# Altium schematic sheet Endregulation.SchDoc
size A3
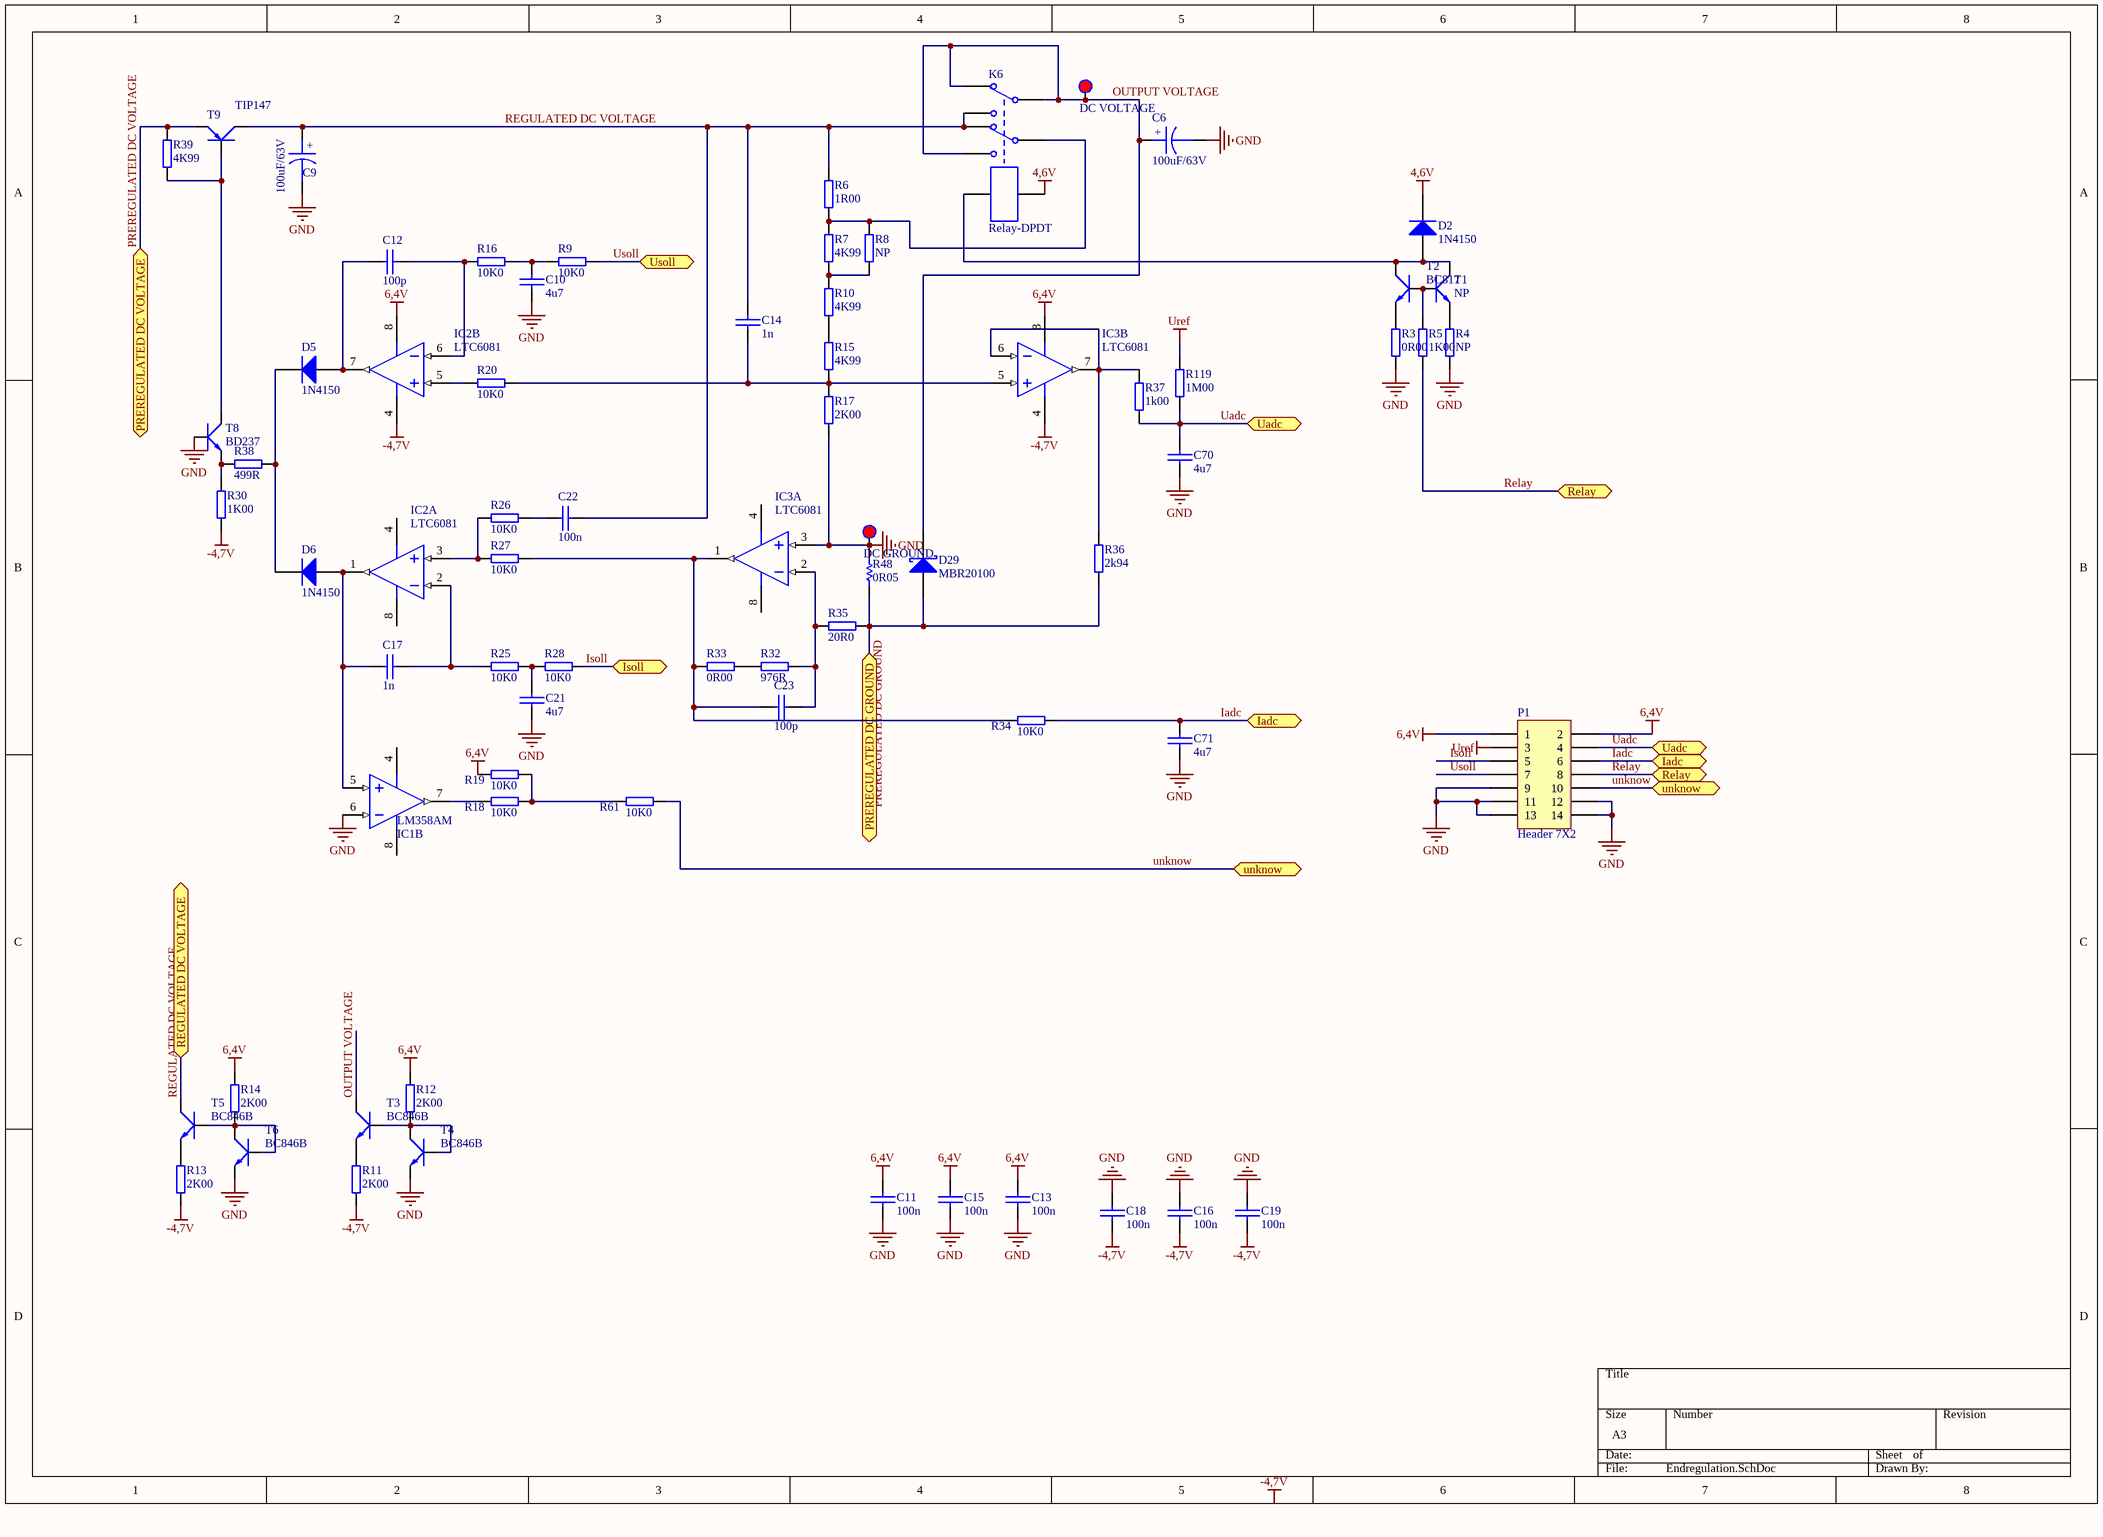
[diagram p0: Endregulation.SchDoc]

## Parts
C6  100uF/63V  [CP2/5]
C9  100uF/63V  [CP2/5]
C10  4u7  [SM-0805]
C11  100n  [SM-0805]
C12  100p  [SM-0805]
C13  100n  [SM-0805]
C14  1n  [SM-0805]
C15  100n  [SM-0805]
C16  100n  [SM-0805]
C17  1n  [SM-0805]
C18  100n  [SM-0805]
C19  100n  [SM-0805]
C21  4u7  [SM-0805]
C22  100n  [SM-0805]
C23  100p  [SM-0805]
C70  4u7  [SM-0805]
C71  4u7  [SM-0805]
D2  1N4150  [SOD80, LL-34]
D5  1N4150  [SOD80, LL-34]
D6  1N4150  [SOD80, LL-34]
D29  MBR20100  [TO-220AC]
DC_GROUND  Testpoint  [vit]  (value not drawn)
DC_VOLTAGE  Testpoint  [vit]  (value not drawn)
IC1  LM358AM  [SO-8]  (part B of 2)
IC2  LTC6081  [SO-8]  (parts A,B of 2)
IC3  LTC6081  [SO-8]  (parts A,B of 2)
K6  Relay-DPDT  [Relay5V]
P1  Header 7X2  [HDR2X7]
R3  0R00  [SM-0805]
R4  NP  [SM-0805]
R5  1K00  [SM-0805]
R6  1R00  [RESTH_AXIAL-0.4]
R7  4K99  [SM-0805]
R8  NP  [SM-0805]
R9  10K0  [SM-0805]
R10  4K99  [SM-0805]
R11  2K00  [SM-0805]
R12  2K00  [SM-0805]
R13  2K00  [SM-0805]
R14  2K00  [SM-0805]
R15  4K99  [SM-0805]
R16  10K0  [SM-0805]
R17  2K00  [SM-0805]
R18  10K0  [SM-0805]
R19  10K0  [SM-0805]
R20  10K0  [SM-0805]
R25  10K0  [SM-0805]
R26  10K0  [SM-0805]
R27  10K0  [SM-0805]
R28  10K0  [SM-0805]
R30  1K00  [SM-0805]
R32  976R  [SM-0805]
R33  0R00  [SM-0805]
R34  10K0  [SM-0805]
R35  20R0  [SM-0805]
R36  2k94  [SM-0805]
R37  1k00  [SM-0805]
R38  499R  [SM-0805]
R39  4K99  [SM-0805]
R48  0R05  [2512]
R61  10K0  [SM-0805]
R119  1M00  [SM-0805]
T1  NP  [SOT23-3]
T2  BC817  [SOT23-3]
T3  BC846B  [SOT23-3]
T4  BC846B  [SOT23-3]
T5  BC846B  [SOT23-3]
T6  BC846B  [SOT23-3]
T8  BD237  [TO-126]
T9  TIP147  [TO-247]

## Ports
Iadc, Isoll, PREREGULATED DC GROUND, PREREGULATED DC VOLTAGE, REGULATED DC VOLTAGE, Relay, Uadc, unknow, Usoll

## Nets
4,6V: D2.2(K) K6.7
6,4V: C11.2 C13.2 C15.2 IC2.8(V+) IC3.8(V+) P1.1 P1.2 R12.2 R14.2 R19.2
-4,7V: C16.1 C18.1 C19.1 IC2.4(GND) IC3.4(GND) R11.2 R13.2 R30.1
GND: C6.2 C9.2 C10.2 C11.1 C13.1 C15.1 C16.2 C18.2 C19.2 C21.2 C70.2 C71.2 DC_GROUND.1 IC1.6(INB-) IC3.3(INA+) P1.9 P1.11 P1.12 P1.13 P1.14 R3.2 R4.1 R17.2 R48.2 T4.3(E) T6.3(E) T8.1(B)
Uref: P1.3 R119.1
Iadc: C71.1 P1.6 R34.1 ; port Iadc
Isoll: P1.5 R28.1 ; port Isoll
OUTPUT VOLTAGE: C6.1 D29.2(K) DC_VOLTAGE.1 K6.1 K6.2 K6.6 T3.2(C)
PREREGULATED DC GROUND: D29.1(A) R35.1 R36.2 R48.1 ; port PREREGULATED DC GROUND
PREREGULATED DC VOLTAGE: R39.1 T9.3(E) ; port PREREGULATED DC VOLTAGE
REGULATED DC VOLTAGE: C9.1 C14.1 C22.1 K6.3 K6.5 R6.1 T5.2(C) T9.2(C) ; port REGULATED DC VOLTAGE
Relay: P1.8 R5.2 ; port Relay
Uadc: C70.1 P1.4 R37.2 R119.2 ; port Uadc
unknow: P1.10 R61.1 ; port unknow
Usoll: P1.7 R9.1 ; port Usoll
NetC10_1: C10.1 R9.2 R16.1
NetC12_1: C12.1 IC2.6(INB-) R16.2
NetC12_2: C12.2 D5.1(A) IC2.7(OUTB)
NetC14_2: C14.2 IC3.5(INB+) R15.2 R17.1 R20.1
NetC17_1: C17.1 D6.1(A) IC1.5(INB+) IC2.1(OUTA)
NetC17_2: C17.2 IC2.2(INA-) R25.2
NetC21_1: C21.1 R25.1 R28.2
NetC22_2: C22.2 R26.1
NetC23_1: C23.1 IC3.2(INA-) R32.1 R35.2
NetC23_2: C23.2 IC3.1(OUTA) R27.1 R33.2 R34.2
NetD2_1: D2.1(A) K6.8 T1.2(C) T2.2(C)
NetD5_2: D5.2(K) D6.2(K) R38.2
NetIC1_7: IC1.7(OUTB) R18.2
NetIC2_3: IC2.3(INA+) R26.2 R27.2
NetIC2_5: IC2.5(INB+) R20.2
NetIC3_6: IC3.6(INB-) IC3.7(OUTB) R36.1 R37.1
NetK6_4: K6.4 R6.2 R7.1 R8.1
NetR3_1: R3.1 T2.3(E)
NetR4_2: R4.2 T1.3(E)
NetR5_1: R5.1 T1.1(B) T2.1(B)
NetR7_2: R7.2 R8.2 R10.1
NetR10_2: R10.2 R15.1
NetR11_1: R11.1 T3.3(E)
NetR12_1: R12.1 T3.1(B) T4.1(B) T4.2(C)
NetR13_1: R13.1 T5.3(E)
NetR14_1: R14.1 T5.1(B) T6.1(B) T6.2(C)
NetR18_1: R18.1 R19.1 R61.2
NetR30_2: R30.2 R38.1 T8.3(E)
NetR32_2: R32.2 R33.1
NetR39_2: R39.2 T8.2(C) T9.1(B)

Not connected (* = marked no-connect by the designer): IC1 4(GND) 8(V+)

## Notes on the sheet
- Labels drawn without touching a wire or pin: -4,7V
- (in symbol CAPACITOR POL) +

## Library data of the parts
C6 C9 = CAPACITOR POL: Capacitor
C10-C19 C21-C23 C70 C71 = CAP: Capacitor
D2 D5 D6 = Diode 1N4007: 1 Amp General Purpose Rectifier; pin to pad: 1>A 2>K; Published: 8-Jun-2000; LatestRevisionDate: 17-Jul-2002; LatestRevisionNote: Re-released for DXP Platform.; DatasheetDocument: 1998; PackageDocument: Aug-1999; PackageReference: DO-41; Publisher: Altium Limited; Code_JEDEC: DO-204-AL; ComponentLink1Description: Manufacturer Link; ComponentLink1URL: http://www.fairchildsemi.com/; ComponentLink2Description: Datasheet; ComponentLink2URL: http://www.fairchildsemi.com/ds/1N%2F1N4001.pdf
D29 = D Schottky: Schottky Diode; pin to pad: 1>3 2>1; Published: 8-Jun-2000; LatestRevisionDate: 17-Jul-2002; LatestRevisionNote: Re-released for DXP Platform.; PackageReference: SMB; Publisher: Altium Limited; PackageDescription: DO-214-AA/SMB; 2 C-Bend Leads; Body 5.3 x 3.6 mm, inc. leads (LxW); Code_JEDEC: DO-214-AA
IC1-IC3 = LM358AM: Low Power Dual Operational Amplifier, 8-pin Narrow SOIC; Manufacturer: National Semiconductor; PackageTopMarking: NSZXTT*LM*358AM; PowerWise: N; CompType: Amplifiers; Published: 4-Dec-2008; LatestRevisionDate: 13-Jan-2009; LatestRevisionNote: Sim Model Added.; DatasheetVersion: Oct-2005; PackageVersion: revM, May-2009; PackageReference: M08A; Publisher: Altium Limited; PackageDescription: SOIC Narrow, 4.9 x 3.9 x 1.45mm, 8 Lead, 1.27mm Pitch; Supplier 1: Farnell; Supplier Part Number 1: 9486801; PartNumber: LM358AM; RoHS: N; PinCount: 8; Code_JEDEC: MS-012-AA; Code_IPC: SOIC127P600-8; ComponentLink1Description: LM358 Datasheet; ComponentLink1URL: http://www.national.com/ds/LM/LM358.pdf; ComponentLink2Description: LM358 Web Page; ComponentLink2URL: http://www.national.com/pf/LM/LM358.html; ComponentLink3Description: M08A Package Page; ComponentLink3URL: http://www.national.com/packaging/folders/m08a.html
K6 = Relay-DPDT: Dual-Pole Dual-Throw Relay; Published: 24-Mar-1999; LatestRevisionDate: 17-Jul-2002; LatestRevisionNote: Re-released for DXP Platform.; PackageReference: DIP-P8; Publisher: Altium Limited
P1 = Header 7X2: Header, 7-Pin, Dual row; LatestRevisionDate: 17-Jul-2002; LatestRevisionNote: Re-released for DXP Platform.; Publisher: Altium Limited
R3-R20 R25-R28 R30 R32-R39 R61 R119 = RES2: tme.vn
R48 = Res Semi: Semiconductor Resistor; Published: *; LatestRevisionDate: *; LatestRevisionNote: *; PackageReference: *; Publisher: *; Value: *
T1-T6 = TIP41C: NPN 2W, BCE BD139; Value: TIP41C
T8 = TIP41C: NPN 2W, BCE BD139; pin to pad: 1>3 3>1; Value: TIP41C
T9 = TIP42C: PNP 2W, BCE Hoang Phat; Value: TIP42C